# Altium project VISION_BETA_EBB.PrjPcb (part 4 of 9)

## Sheet HDMI.SchDoc
size A2; SheetNumber: 6; SheetTotal: 19
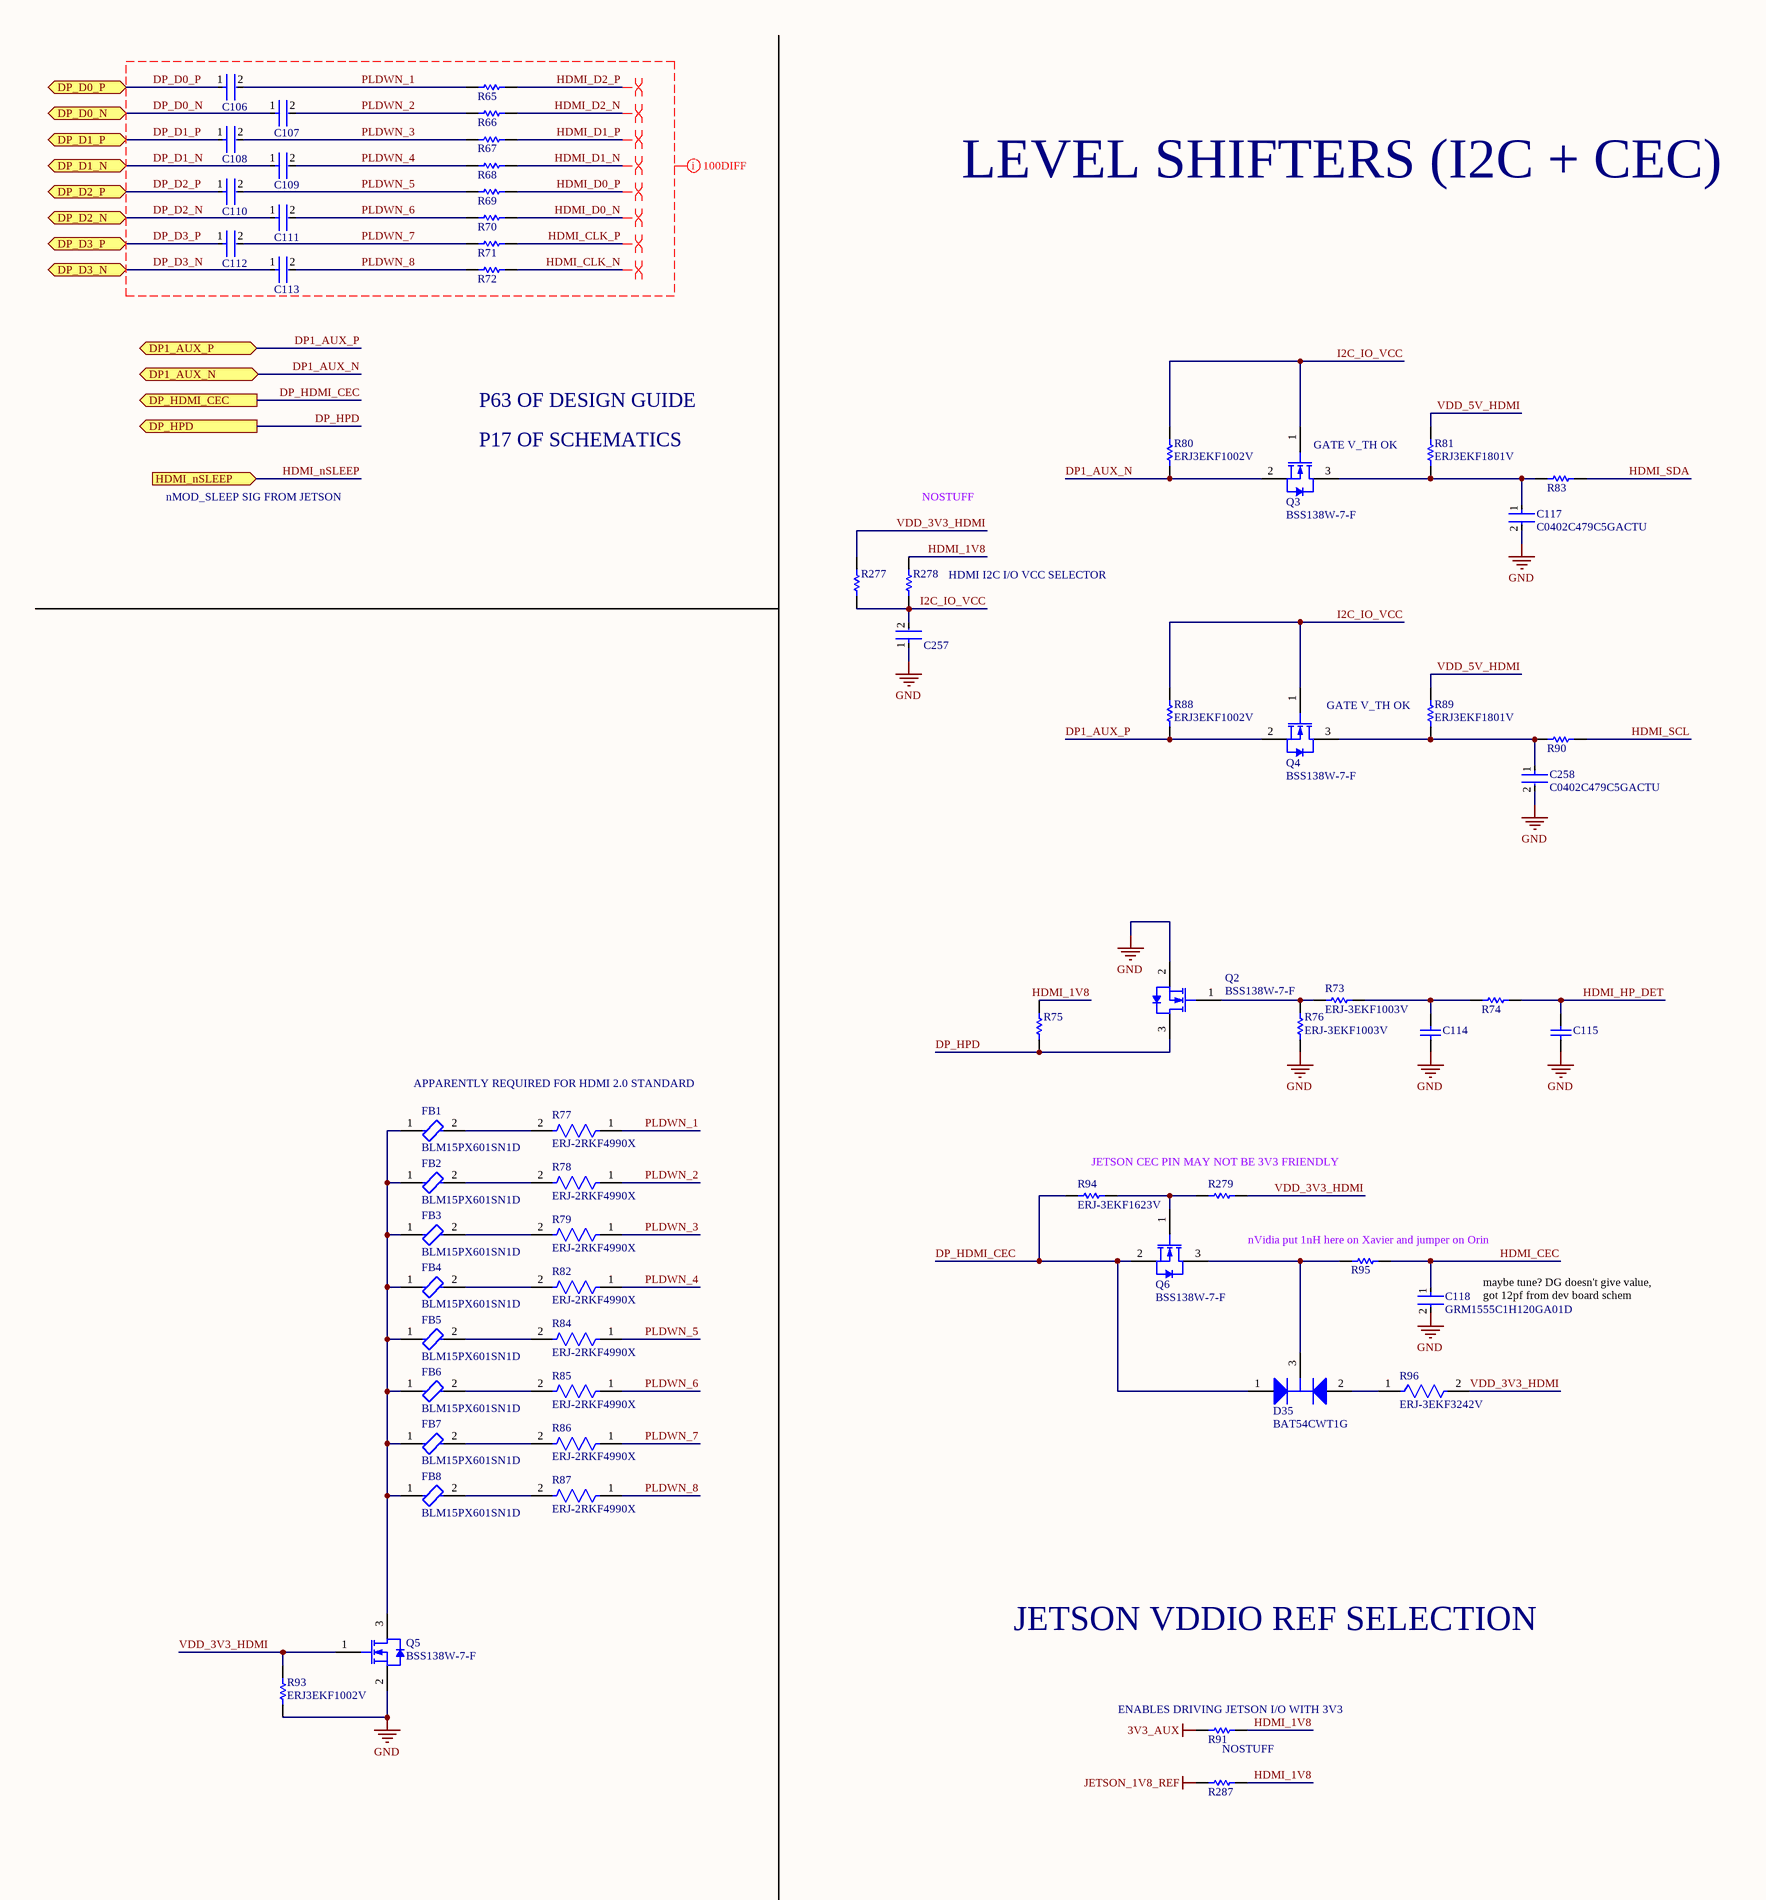
[diagram p19: HDMI.SchDoc, left]
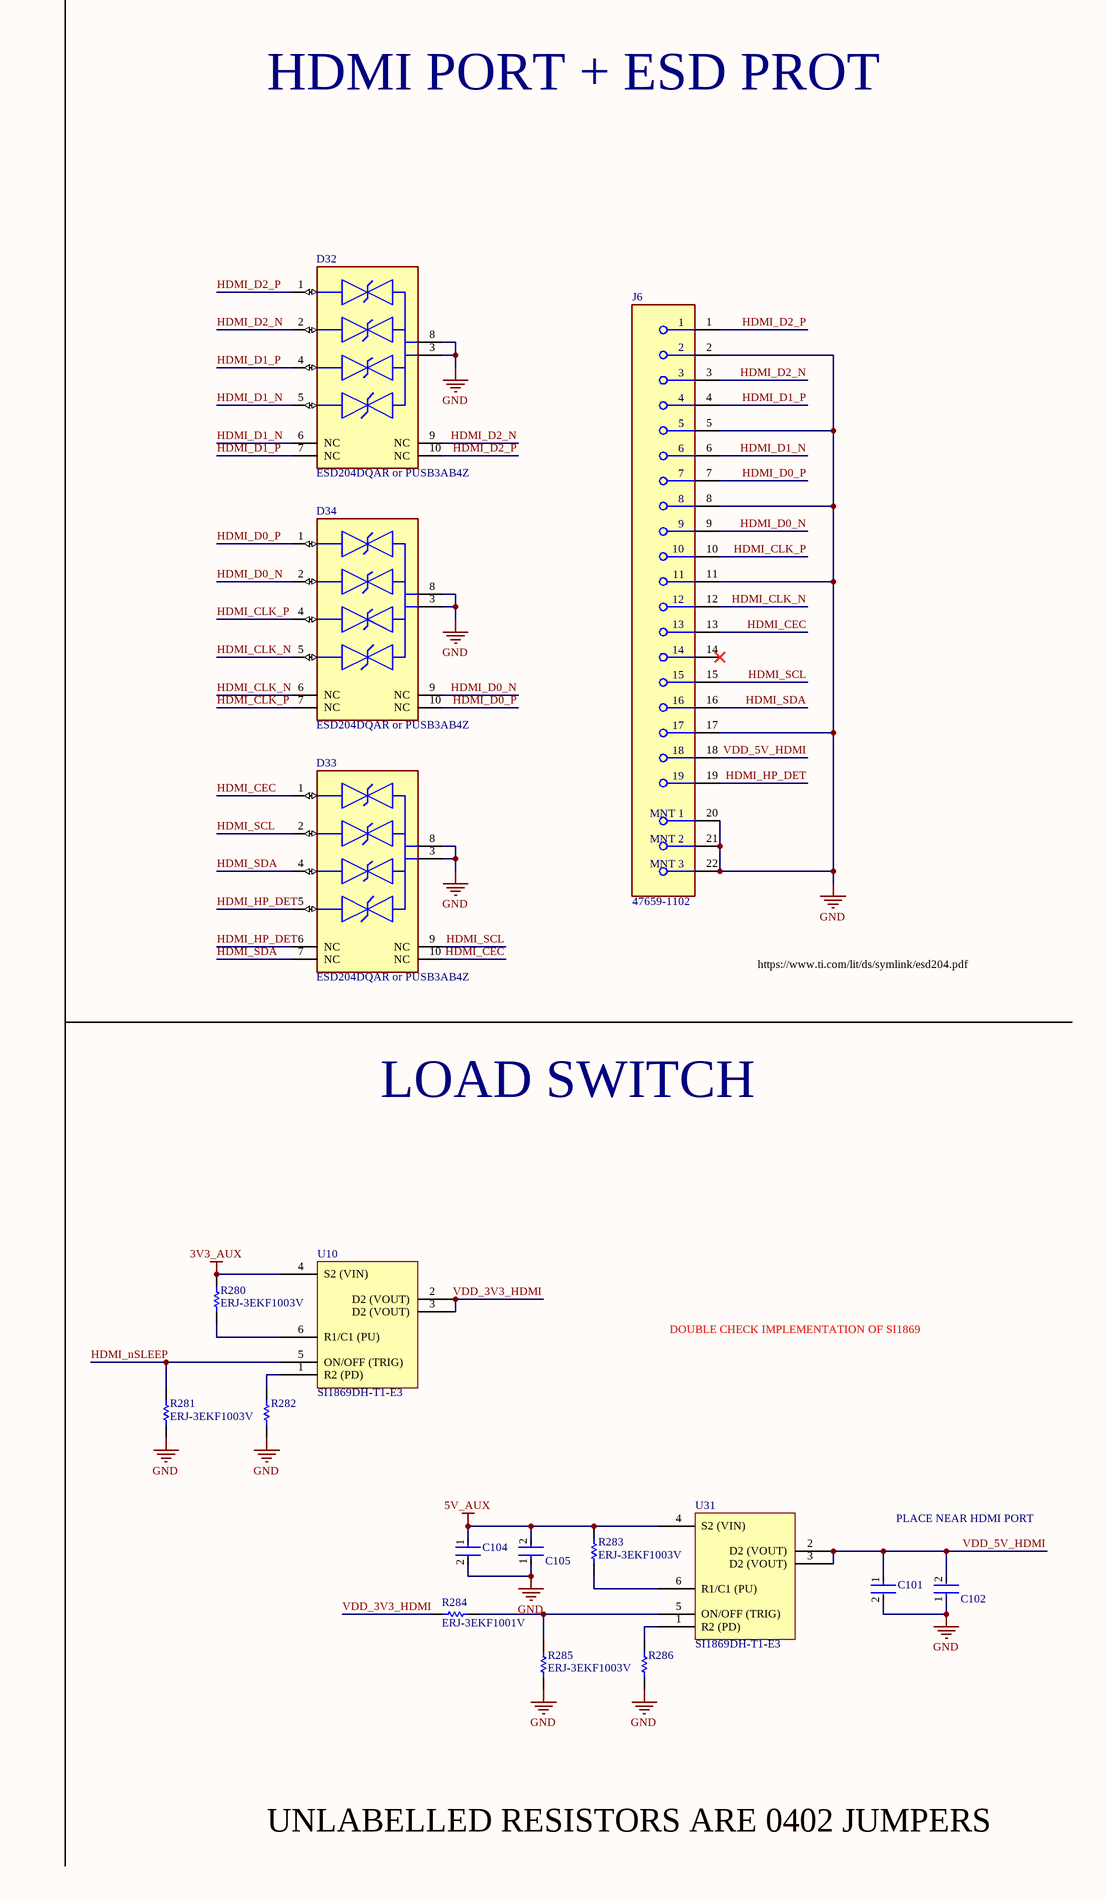
[diagram p20: HDMI.SchDoc, right]

### Parts
C101  GRM188R60J106ME47D  [FP-GRM188-0_1-e0_2_0_55-IPC_A]  (value not drawn)
C102  C1005X7R1H104K050BB  [FP-C1005-050-0_05-IPC_C]  (value not drawn)
C104  GRM188R60J106ME47D  [FP-GRM188-0_1-e0_2_0_55-IPC_A]  (value not drawn)
C105  C1005X7R1H104K050BB  [FP-C1005-050-0_05-IPC_C]  (value not drawn)
C106  C1005X7R1H104K050BB  [FP-C1005-050-0_05-IPC_C]  (value not drawn)
C107  C1005X7R1H104K050BB  [FP-C1005-050-0_05-IPC_C]  (value not drawn)
C108  C1005X7R1H104K050BB  [FP-C1005-050-0_05-IPC_C]  (value not drawn)
C109  C1005X7R1H104K050BB  [FP-C1005-050-0_05-IPC_C]  (value not drawn)
C110  C1005X7R1H104K050BB  [FP-C1005-050-0_05-IPC_C]  (value not drawn)
C111  C1005X7R1H104K050BB  [FP-C1005-050-0_05-IPC_C]  (value not drawn)
C112  C1005X7R1H104K050BB  [FP-C1005-050-0_05-IPC_C]  (value not drawn)
C113  C1005X7R1H104K050BB  [FP-C1005-050-0_05-IPC_C]  (value not drawn)
C114  C0402C221K5RAC7867  [CAPC1005X60X30NL05T10]  (value not drawn)
C115  C0402C221K5RAC7867  [CAPC1005X60X30NL05T10]  (value not drawn)
C117  C0402C479C5GACTU  [FP-C0402-BB-MFG]
C118  GRM1555C1H120GA01D  [FP-GRM155-0_05-MFG]
C257  C1005X7R1H104K050BB  [FP-C1005-050-0_05-IPC_C]  (value not drawn)
C258  C0402C479C5GACTU  [FP-C0402-BB-MFG]
D32  ESD204DQAR or PUSB3AB4Z  [FP-DQA0010A-MFG]
D33  ESD204DQAR or PUSB3AB4Z  [FP-DQA0010A-MFG]
D34  ESD204DQAR or PUSB3AB4Z  [FP-DQA0010A-MFG]
D35  BAT54CWT1G  [ONSC-SOT-323-3-419-04_V]
FB1  BLM15PX601SN1D  [FP-BLM15-0_05-MFG]
FB2  BLM15PX601SN1D  [FP-BLM15-0_05-MFG]
FB3  BLM15PX601SN1D  [FP-BLM15-0_05-MFG]
FB4  BLM15PX601SN1D  [FP-BLM15-0_05-MFG]
FB5  BLM15PX601SN1D  [FP-BLM15-0_05-MFG]
FB6  BLM15PX601SN1D  [FP-BLM15-0_05-MFG]
FB7  BLM15PX601SN1D  [FP-BLM15-0_05-MFG]
FB8  BLM15PX601SN1D  [FP-BLM15-0_05-MFG]
J6  47659-1102  [FP-47659-1102-MFG]
Q2  BSS138W-7-F  [DIOD-SOT323-3_V]
Q3  BSS138W-7-F  [DIOD-SOT323-3_V]
Q4  BSS138W-7-F  [DIOD-SOT323-3_V]
Q5  BSS138W-7-F  [DIOD-SOT323-3_V]
Q6  BSS138W-7-F  [DIOD-SOT323-3_V]
R65  0402 JUMPER  [RESC1005X40X25ML05T05]  (value not drawn)
R66  0402 JUMPER  [RESC1005X40X25ML05T05]  (value not drawn)
R67  0402 JUMPER  [RESC1005X40X25ML05T05]  (value not drawn)
R68  0402 JUMPER  [RESC1005X40X25ML05T05]  (value not drawn)
R69  0402 JUMPER  [RESC1005X40X25ML05T05]  (value not drawn)
R70  0402 JUMPER  [RESC1005X40X25ML05T05]  (value not drawn)
R71  0402 JUMPER  [RESC1005X40X25ML05T05]  (value not drawn)
R72  0402 JUMPER  [RESC1005X40X25ML05T05]  (value not drawn)
R73  ERJ-3EKF1003V  [RESC1608X55X30ML15T15]
R74  0402 JUMPER  [RESC1005X40X25ML05T05]  (value not drawn)
R75  ERJ3EKF1002V  [RESC1609X55X30LL15T15]  (value not drawn)
R76  ERJ-3EKF1003V  [RESC1608X55X30ML15T15]
R77  ERJ-2RKF4990X  [FP-ERJ2RK-MFG]
R78  ERJ-2RKF4990X  [FP-ERJ2RK-MFG]
R79  ERJ-2RKF4990X  [FP-ERJ2RK-MFG]
R80  ERJ3EKF1002V  [RESC1609X55X30LL15T15]
R81  ERJ3EKF1801V  [RESC1608X55X30LL15T15]
R82  ERJ-2RKF4990X  [FP-ERJ2RK-MFG]
R83  0402 JUMPER  [RESC1005X40X25ML05T05]  (value not drawn)
R84  ERJ-2RKF4990X  [FP-ERJ2RK-MFG]
R85  ERJ-2RKF4990X  [FP-ERJ2RK-MFG]
R86  ERJ-2RKF4990X  [FP-ERJ2RK-MFG]
R87  ERJ-2RKF4990X  [FP-ERJ2RK-MFG]
R88  ERJ3EKF1002V  [RESC1609X55X30LL15T15]
R89  ERJ3EKF1801V  [RESC1608X55X30LL15T15]
R90  0402 JUMPER  [RESC1005X40X25ML05T05]  (value not drawn)
R91  0402 JUMPER  [RESC1005X40X25ML05T05]  (value not drawn)
R93  ERJ3EKF1002V  [RESC1609X55X30LL15T15]
R94  ERJ-3EKF1623V  [RESC1608X55X30ML15T15]
R95  0402 JUMPER  [RESC1005X40X25ML05T05]  (value not drawn)
R96  ERJ-3EKF3242V  [FP-ERJ3EK-MFG]
R277  0402 JUMPER  [RESC1005X40X25ML05T05]  (value not drawn)
R278  0402 JUMPER  [RESC1005X40X25ML05T05]  (value not drawn)
R279  0402 JUMPER  [RESC1005X40X25ML05T05]  (value not drawn)
R280  ERJ-3EKF1003V  [RESC1608X55X30ML15T15]
R281  ERJ-3EKF1003V  [RESC1608X55X30ML15T15]
R282  0402 JUMPER  [RESC1005X40X25ML05T05]  (value not drawn)
R283  ERJ-3EKF1003V  [RESC1608X55X30ML15T15]
R284  ERJ-3EKF1001V  [RESC1608X55X30LL15T15]
R285  ERJ-3EKF1003V  [RESC1608X55X30ML15T15]
R286  0402 JUMPER  [RESC1005X40X25ML05T05]  (value not drawn)
R287  0402 JUMPER  [RESC1005X40X25ML05T05]  (value not drawn)
U10  SI1869DH-T1-E3  [SOT65P242X110-6N]
U31  SI1869DH-T1-E3  [SOT65P242X110-6N]

### Ports
DP1_AUX_N (bidir, see VISION_BETA_EBB[6C], JETSON[9C]), DP1_AUX_P (bidir, see VISION_BETA_EBB[6C], JETSON[9C]), DP_D0_N (bidir, see VISION_BETA_EBB[6C]), DP_D0_P (bidir, see VISION_BETA_EBB[6C]), DP_D1_N (bidir, see VISION_BETA_EBB[6C]), DP_D1_P (bidir, see VISION_BETA_EBB[6C]), DP_D2_N (bidir, see VISION_BETA_EBB[6C]), DP_D2_P (bidir, see VISION_BETA_EBB[6C]), DP_D3_N (bidir, see VISION_BETA_EBB[6C]), DP_D3_P (bidir, see VISION_BETA_EBB[6C]), DP_HDMI_CEC (out, see VISION_BETA_EBB[6C], JETSON[9C]), DP_HPD (out, see VISION_BETA_EBB[6C]), HDMI_nSLEEP (in, see VISION_BETA_EBB[6C])

### Nets
3V3_AUX: R91.1 R280.2 U10.4(S2_(VIN))  [project net 3V3_AUX_FB]
5V_AUX: C104.1 C105.2 R283.2 U31.4(S2_(VIN))  [project net 5V_REG_FB]
GND: C101.2 C102.1 C104.2 C105.1 C114.1 C115.1 C117.2 C118.2 C257.1 C258.2 D32.3(GND) D32.8(GND) D33.3(GND) D33.8(GND) D34.3(GND) D34.8(GND) J6.2 J6.5 J6.8 J6.11 J6.17 J6.20(MNT_1) J6.21(MNT_2) J6.22(MNT_3) Q2.2(S) Q5.2(S) R76.1 R93.1 R281.1 R282.2 R285.1 R286.2
JETSON_1V8_REF: R287.1  [project net FAN_VDDIO]
DP1_AUX_N: Q3.2(S) R80.1 ; port DP1_AUX_N
DP1_AUX_P: Q4.2(S) R88.1 ; port DP1_AUX_P
DP_D0_N: C107.1 ; port DP_D0_N  [project net DP1_TXD0_N]
DP_D0_P: C106.1 ; port DP_D0_P  [project net DP1_TXD0_P]
DP_D1_N: C109.1 ; port DP_D1_N  [project net DP1_TXD1_N]
DP_D1_P: C108.1 ; port DP_D1_P  [project net DP1_TXD1_P]
DP_D2_N: C111.1 ; port DP_D2_N  [project net DP1_TXD2_N]
DP_D2_P: C110.1 ; port DP_D2_P  [project net DP1_TXD2_P]
DP_D3_N: C113.1 ; port DP_D3_N  [project net DP1_TXD3_N]
DP_D3_P: C112.1 ; port DP_D3_P  [project net DP1_TXD3_P]
DP_HDMI_CEC: D35.1(A1) Q6.2(S) R94.1 ; port DP_HDMI_CEC
DP_HPD: Q2.3(D) R75.1 ; port DP_HPD  [project net DP1_HPD]
HDMI_1V8: R75.2 R91.2 R278.2 R287.2
HDMI_CEC: C118.1 D33.1(IO1) D33.10(NC) J6.13 R95.2
HDMI_CLK_N: D34.5(IO4) D34.6(NC) J6.12 R72.2
HDMI_CLK_P: D34.4(IO3) D34.7(NC) J6.10 R71.2
HDMI_D0_N: D34.2(IO2) D34.9(NC) J6.9 R70.2
HDMI_D0_P: D34.1(IO1) D34.10(NC) J6.7 R69.2
HDMI_D1_N: D32.5(IO4) D32.6(NC) J6.6 R68.2
HDMI_D1_P: D32.4(IO3) D32.7(NC) J6.4 R67.2
HDMI_D2_N: D32.2(IO2) D32.9(NC) J6.3 R66.2
HDMI_D2_P: D32.1(IO1) D32.10(NC) J6.1 R65.2
HDMI_HP_DET: C115.2 D33.5(IO4) D33.6(NC) J6.19 R74.2
HDMI_nSLEEP: R281.2 U10.5(ON/OFF_(TRIG)) ; port HDMI_nSLEEP
HDMI_SCL: D33.2(IO2) D33.9(NC) J6.15 R90.2
HDMI_SDA: D33.4(IO3) D33.7(NC) J6.16 R83.2
I2C_IO_VCC: C257.2 Q3.1(G) Q4.1(G) R80.2 R88.2 R277.1 R278.1
PLDWN_1: C106.2 R65.1 R77.1
PLDWN_2: C107.2 R66.1 R78.1
PLDWN_3: C108.2 R67.1 R79.1
PLDWN_4: C109.2 R68.1 R82.1
PLDWN_5: C110.2 R69.1 R84.1
PLDWN_6: C111.2 R70.1 R85.1
PLDWN_7: C112.2 R71.1 R86.1
PLDWN_8: C113.2 R72.1 R87.1
VDD_3V3_HDMI: Q5.1(G) R93.2 R96.2 R277.2 R279.1 R284.1 U10.2(D2_(VOUT)) U10.3(D2_(VOUT))
VDD_5V_HDMI: C101.1 C102.2 J6.18 R81.2 R89.2 U31.2(D2_(VOUT)) U31.3(D2_(VOUT))
NetC114_2: C114.2 R73.2 R74.1
NetC117_1: C117.1 Q3.3(D) R81.1 R83.1
NetC258_1: C258.1 Q4.3(D) R89.1 R90.1
NetD35_2: D35.2(A2) R96.1
NetD35_3: D35.3(K) Q6.3(D) R95.1
NetFB1_1: FB1.1 FB2.1 FB3.1 FB4.1 FB5.1 FB6.1 FB7.1 FB8.1 Q5.3(D)
NetFB1_2: FB1.2 R77.2
NetFB2_2: FB2.2 R78.2
NetFB3_2: FB3.2 R79.2
NetFB4_2: FB4.2 R82.2
NetFB5_2: FB5.2 R84.2
NetFB6_2: FB6.2 R85.2
NetFB7_2: FB7.2 R86.2
NetFB8_2: FB8.2 R87.2
NetQ2_1: Q2.1(G) R73.1 R76.2
NetQ6_1: Q6.1(G) R94.2 R279.2
NetR280_1: R280.1 U10.6(R1/C1_(PU))
NetR282_1: R282.1 U10.1(R2_(PD))
NetR283_1: R283.1 U31.6(R1/C1_(PU))
NetR284_2: R284.2 R285.2 U31.5(ON/OFF_(TRIG))
NetR286_1: R286.1 U31.1(R2_(PD))

Not connected (* = marked no-connect by the designer): J6 14*

### Layout directives
differential pair; differential pair class 100DIFF: HDMI_CLK_N, HDMI_CLK_P, HDMI_D0_N, HDMI_D0_P, HDMI_D1_N, HDMI_D1_P, HDMI_D2_N, HDMI_D2_P
net class 100DIFF: DP_D0_N, DP_D0_P, DP_D1_N, DP_D1_P, DP_D2_N, DP_D2_P, DP_D3_N, DP_D3_P, HDMI_CLK_N, HDMI_CLK_P, HDMI_D0_N, HDMI_D0_P, HDMI_D1_N, HDMI_D1_P, HDMI_D2_N, HDMI_D2_P, PLDWN_1, PLDWN_2, PLDWN_3, PLDWN_4, PLDWN_5, PLDWN_6, PLDWN_7, PLDWN_8

### Notes on the sheet
- HDMI PORT + ESD PROT
- LEVEL SHIFTERS (I2C + CEC)
- P63 OF DESIGN GUIDE
- nMOD_SLEEP SIG FROM JETSON
- P17 OF SCHEMATICS
- NOSTUFF
- (near Q3) GATE V_TH OK
- HDMI I2C I/O VCC SELECTOR
- (near Q4) GATE V_TH OK
- APPARENTLY REQUIRED FOR HDMI 2.0 STANDARD
- https://www.ti.com/lit/ds/symlink/esd204.pdf
- JETSON CEC PIN MAY NOT BE 3V3 FRIENDLY
- LOAD SWITCH
- (near R95) nVidia put 1nH here on Xavier and jumper on Orin
- maybe tune? DG doesn't give value, got 12pf from dev board schem
- DOUBLE CHECK IMPLEMENTATION OF SI1869
- JETSON VDDIO REF SELECTION
- PLACE NEAR HDMI PORT
- (near R91) ENABLES DRIVING JETSON I/O WITH 3V3
- (near R91) NOSTUFF
- UNLABELLED RESISTORS ARE 0402 JUMPERS

### Library data of the parts
C101 C104 = CMP-2006-02792-2: Chip Multilayer Ceramic Capacitors for General Purpose, 0603, 10uF, X5R, 15%, 20%, 6.3V; Packaging: Tape and Reel; Voltage Rating (DC): 6.3V; Width: 0.031inch; Termination: SMD/SMT; Dielectric: X5R; Package Quantity: 4000; Voltage Rating: 6.3V; Capacitance: 10uF; Case/Package: 0603; Min Operating Temperature: -55°C; Voltage: 6.3V; Length: 1.6mm; Thickness: 0.035inch; Lead Free: Lead Free; Depth: 0.8mm; Case Code (Imperial): 0603; Max Operating Temperature: 85°C; Material: Ceramic; Height: 0.8mm; Tolerance: 20%; Mount: Surface Mount; REACH SVHC: No SVHC; Radiation Hardening: No; Case Code (Metric): 1608
C102 C105-C113 C257 = CMP-2000-05393-2: Multilayer Ceramic Capacitors 100nF ±10% 50V X7R SMD 0402; Voltage: 50V; Dielectric Material: Ceramic; Min Operating Temperature: -55°C; Depth: 0.5mm; Radiation Hardening: No; RoHS Compliant: Yes; Voltage Rating (DC): 50V; Lead Free: Lead Free; Resistor Type: Ceramic; Height: 0.5mm; Dielectric: X7R; Thickness: 0.022inch; Case/Package: 0402; Case Code (Metric): 1005; Termination: SMD/SMT; Capacitance: 100nF; Packaging: Tape and Reel; Max Operating Temperature: 125°C; Mount: Surface Mount; Package Quantity: 1; Width: 0.02inch; Weight: 2.3E-05oz; Voltage Rating: 50V; Tolerance: 10%; Construction: Flat; Case Code (Imperial): 0402; Length: 1mm; REACH SVHC: No SVHC; Series: C
C114 C115 = CMP-2008-03137-2: Manufacturer: Kemet; Part Number: C0402C221K5RAC7867
C117 C258 = CMP-2008-03310-2: CAP CER 4.7PF 50V NP0 0402; Manufacturer: Kemet; Material: Ceramic; Tolerance: 0.25 pF; Temperature Coefficient: 15%; Temperature Characteristic: C0G; Manufacturer Part Number: C0402C479C5GACTU; Lead Free: Yes; Device Class L1: Passive Components; ComponentLink2Description: Datasheet; Temperature: -55°C to +125°C; Digikey Description: CAP CER 4.7PF 50V NP0 0402; Ipc Land Pattern Name: CAPC10050X50; ComponentLink2URL: https://content.kemet.com/datasheets/KEM_C1002_X7R_SMD.pdf; Octopart: https://octopart.com/c0402c479c5gactu-kemet-9144199; Mouser Description: Multilayer Ceramic Capacitors MLCC - SMD/SMT 50volts 4.7pF C0G .25pF; Automotive: No; Voltage Rating: 50 V; Device Class L3: Ceramic Capacitors; Capacitance: 4.7 pF; Category: Cap; Value: 4.7 pF; Package: C0402-BB; Height: 0.55mm; Temperature Range Low: -55°C; RoHS: TRUE; Device Class L2: Capacitors; Temperature Range High: +125°C
C118 = CMP-2008-03945-2: CAP CER 12PF 50V C0G/NP0 0402; Tolerance: 2%; Dielectric: C0G; Material: Ceramic; Termination: SMD/SMT; Mount: Surface Mount; REACH SVHC: No SVHC; Depth: 0.5mm; Case Code (Metric): 1005; Voltage Rating: 50V; Height: 0.5mm; Voltage Rating (DC): 50V; Case Code (Imperial): 0402; Package Quantity: 10000; Construction: Flat; Thickness: 0.022inch; Length: 1mm; Min Operating Temperature: -55°C; Width: 0.5mm; Lead Free: Lead Free; Capacitance: 12pF; Case/Package: 0402; Packaging: Tape and Reel; Series: GRM; Voltage: 50V; Radiation Hardening: No; Max Operating Temperature: 125°C
D32-D34 = CMP-04989-000002-1: 4-CHANNEL LOW-CAPACITANCE SURGE; Manufacturer: Texas Instruments; Value: 0.55pF; Reverse Standoff Voltage: 3.6V; Standoff Height: 0mm; Breakdown Voltage: 5.5V; Peak Pulse Current: 5.5A; Clamping Voltage: 11.5V; Direction: Bidirectional; Peak Pulse Power: 50W; Number Of Channels: 4; Ambient Temperature Range High: +125°C; ComponentLink2Description: Datasheet; Height: 0.55mm; Lead Free: Yes; Device Class L3: unset; Temperature Range High: +125°C; Temperature Range Low: -40°C; Package: DQA0010A; Temperature: -40°C to +125°C; Capacitance: 0.55pF; RoHS: TRUE; Mouser Description: 4-Channel Low-Capacitance Surge and ESD Protection Diode 10-USON -40 to 125; Category: Diode; Device Class L1: Circuit Protection; Octopart: https://octopart.com/esd204dqar-texas+instruments-89917476; Device Class L2: TVS Diodes; Ambient Temperature Range Low: -40°C; Manufacturer Part Number: ESD204DQAR; ComponentLink2URL: http://www.ti.com/lit/ds/symlink/esd204.pdf; Automotive: No; Digikey Description: 4-CHANNEL LOW-CAPACITANCE SURGE
D35 = CMP-1055-00557-1: Dual Series Cathode Schottky Barrier Diodes, 3-Pin SOT-323, Pb-Free, Tape and Reel; Manufacturer: On Semiconductor; Configuration: Common Cathode; IFSM Max (A): 0.6; trr Max (ns): 5; ComponentLink2Description: Datasheet; Packing: Tape and Reel; ComponentLink3Description: Package Specification; Mounting Technology: Surface Mount; PartNumber: BAT54CWT1G; PackageVersion: Rev. N, 11/2008; RoHS: TRUE; ComponentLink3URL: http://www.onsemi.com/pub_link/Collateral/419-04.PDF; ComponentLink2URL: http://www.onsemi.cn/pub_link/Collateral/BAT54CWT1-D.PDF; PackageReference: SOT-323-3-419-04; ComponentLink1URL: http://www.onsemi.com/; ComponentLink1Description: Manufacturer URL; DatasheetVersion: Rev. 7; PackageDescription: 3-Pin Small Outline Transistor, Body 2 x 1.25 mm, Pitch 0.65 mm
FB1-FB8 = CMP-0686-00252-4: Chip Ferrite Bead, 0402, 600Ω @ 100MHz, 0.23Ω, 25%, 900mA; Number of Circuits: 1; Impedance: 600R; DC Resistance (DCR): 230mR; Material: Steel; Length: 1mm; Package Quantity: 10000; Height: 0.5mm; Width: 0.5mm; Max DC Current: 900mA; Number of Lines: 1; Termination: SMD/SMT; Packaging: Tape and Reel; Lead Free: Lead Free; Min Operating Temperature: -55°C; Max Operating Temperature: 125°C; Max Current Rating: 900mA; Case Code (Imperial): 0402; Number of Pins: 2; Current Rating: 900mA; Test Frequency: 100MHz; Case/Package: 0402; Tolerance: 25%; Case Code (Metric): 1005
J6 = CMP-04768-000010-1: HDMI REC.VERTICAL SMT TYPE W/HEI; RoHS Compliant: Yes
Q2-Q6 = CMP-2000-05968-1: N-Channel Enhancement Mode Mosfet, 50 V, 200 mA, -55 to 150 degC, 6-Pin SOT-323, RoHS, Tape and Reel; Typical Turn-Off Delay Time: 20ns; Number of Channels: 1Channel; Type: EnhancementModeFieldEffectTransistor; Brand: DiodesIncorporated; Vds - Drain-Source Breakdown Voltage: 75V; Vgs - Gate-Source Voltage: 20V; Rds On - Drain-Source Resistance: 1.4Ohms; Transistor Type: 1N-Channel; Configuration: Single; Unit Weight: 0.000212oz; Pd - Power Dissipation: 200mW; Id - Continuous Drain Current: 200mA; Forward Transconductance - Min: 0.1S; Manufacturer URL: http://www.diodes.com/; Series: BSS138; Package Description: 3-Pin Small Outline Transistor, Body 2 x 1.25 mm, Pitch 0.65 mm; Mounting Technology: SurfaceMount; Product Category: MOSFET; RoHS: True; Maximum Operating Temperature: +150C; Height: 1mm; Length: 2.2mm; Technology: Si; Width: 1.35mm; Datasheet URL: http://www.diodes.com/_files/datasheets/ds30206.pdf; Manufacturer: DiodesIncorporated; Package / Case: SOT-323-3; Typical Turn-On Delay Time: 20ns; Transistor Polarity: N-Channel; Factory Pack Quantity: 3000; Packaging: Reel; Product: MOSFETSmallSignal; Datasheet Version: Rev. 11-2, 09/2013; Package Reference: SOT323; Minimum Operating Temperature: -55C; Mounting Style: SMD/SMT; Channel Mode: Enhancement
R65-R72 R74 R83 R90 R91 R95 R277-R279 R282 R286 R287 = CMP-009-00118-2: READ THE NAME; Pins: 2; Component Type: Standard; Design Item ID: CMP-009-00206-2; Source: 0402jump.SchLib
R73 R76 R280 R281 R283 R285 = CMP-2000-00182-1: Manufacturer: Panasonic; Part Number: ERJ-3EKF1003V
R75 R80 R88 R93 = CMP-1012-00623-3: Chip Resistor, 10 KOhm, +/- 1%, 0.1 W, -55 to 155 degC, 0603 (1608 Metric), RoHS, Tape and Reel; Manufacturer: Panasonic; Voltage Rating: 75V; Case\/Package: 0603; Power Rating: 100mW; Resistance: 10KOhm; Temperature Coefficient: 100ppm\/degreesC; Number of Pins: 2; Package Reference: 603; Depth: 0.8mm; Mount: SurfaceMount; Package Description: 2-Pin Surface Mount Device, Body 1.6 x 0.85 mm; Datasheet Version: 02/2017; Length: 1.6mm; Lead Free: LeadFree; Height: 0.45mm; Number of Terminations: 2; Max Power Dissipation: 100mW; Min Operating Temperature: -55degC; Datasheet URL: https://industrial.panasonic.com/cdbs/www-data/pdf/RDA0000/AOA0000C304.pdf; Termination: SMD/SMT; Case Code (Metric): 1608; Case Code (Imperial): 0603; Tolerance: 1%; Max Operating Temperature: 155degC; RoHSCompliant: true; Voltage Rating (DC): 75V; Radiation Hardening: No; Packaging: TapeandReel; Composition: ThickFilm; Mounting Technology: SurfaceMount; Manufacturer URL: http://www.panasonic.com/; Width: 0.031inch; REACH SVHC: NoSVHC; Contact Plating: Tin; Military Standard: Not; Package Quantity: 1
R77-R79 R82 R84-R87 = CMP-2002-00965-2: RES SMD 499 OHM 1% 1/10W 0402; Temperature Coefficient: 100ppm/°C; Max Power Dissipation: 100mW; Voltage Rating (DC): 50V; Resistance: 499R; Technology: THICK FILM; Min Operating Temperature: -55°C; Package Quantity: 1; Width: 0.02inch; Contact Plating: Tin; Tolerance: 1%; Features: Automotive AEC-Q200; Resistance Tolerance: 1%; Size Code: 0402; Military Standard: Not; Resistor Type: Thick Film; Case/Package: 0402; Mount: Surface Mount; Case Code (Metric): 1005; RoHS Compliant: Yes; REACH SVHC: No SVHC; Number of Terminations: 2; Construction: Rectangular; Packaging: Tape and Reel; Series: ERJ; Lead Free: Lead Free; Length: 1mm; Voltage Rating: 50V; Termination: SMD/SMT; Max Operating Temperature: 155°C; Case Code (Imperial): 0402; Height: 0.35mm; Power Rating: 100mW; Depth: 0.5mm
R81 R89 = CMP-2000-00389-1: MODIFIED P/N; Manufacturer: Panasonic; Part Number: ERJ3EKF2701V
R94 = CMP-1012-00758-2: Manufacturer: Panasonic; Part Number: ERJ-3EKF1623V
R96 = CMP-2000-00433-2: RES SMD 32.4K OHM 1% 1/10W 0603; Voltage Rating: 75V; Max Power Dissipation: 100mW; Temperature Coefficient: 100ppm/°C; Resistance: 32.4kR; Voltage Rating (DC): 50V; Technology: THICK FILM; Tolerance: 1%; Features: Automotive AEC-Q200; Width: 0.8mm; Case/Package: 0603; Min Operating Temperature: -55°C; Power Rating: 100mW; Contact Plating: Tin; Case Code (Imperial): 0603; Number of Terminations: 2; Lead Free: Lead Free; Length: 1.6mm; Series: ERJ; Packaging: Tape and Reel; RoHS Compliant: Yes; Military Standard: Not; Termination: SMD/SMT; Case Code (Metric): 1608; Max Operating Temperature: 155°C; Package Quantity: 1; Mount: Surface Mount; Resistor Type: Thick Film; Construction: Rectangular; Height: 0.45mm; Resistance Tolerance: 1%; Depth: 0.8mm; Radiation Hardening: No
R284 = CMP-2000-00180-1: Manufacturer: Panasonic; Part Number: ERJ-3EKF1001V
U10 U31 = CMP-019-00043-2: Power Supply Support Circuit, Adjustable, 1 Channel, PDSO6; Max Supply Voltage: 20V; Min Supply Voltage: 1.8V; Case/Package: TSSOP; Pins: 6; RoHS Compliant: Yes

## Sheet NVME.SchDoc
size C; SheetNumber: 7; SheetTotal: 19
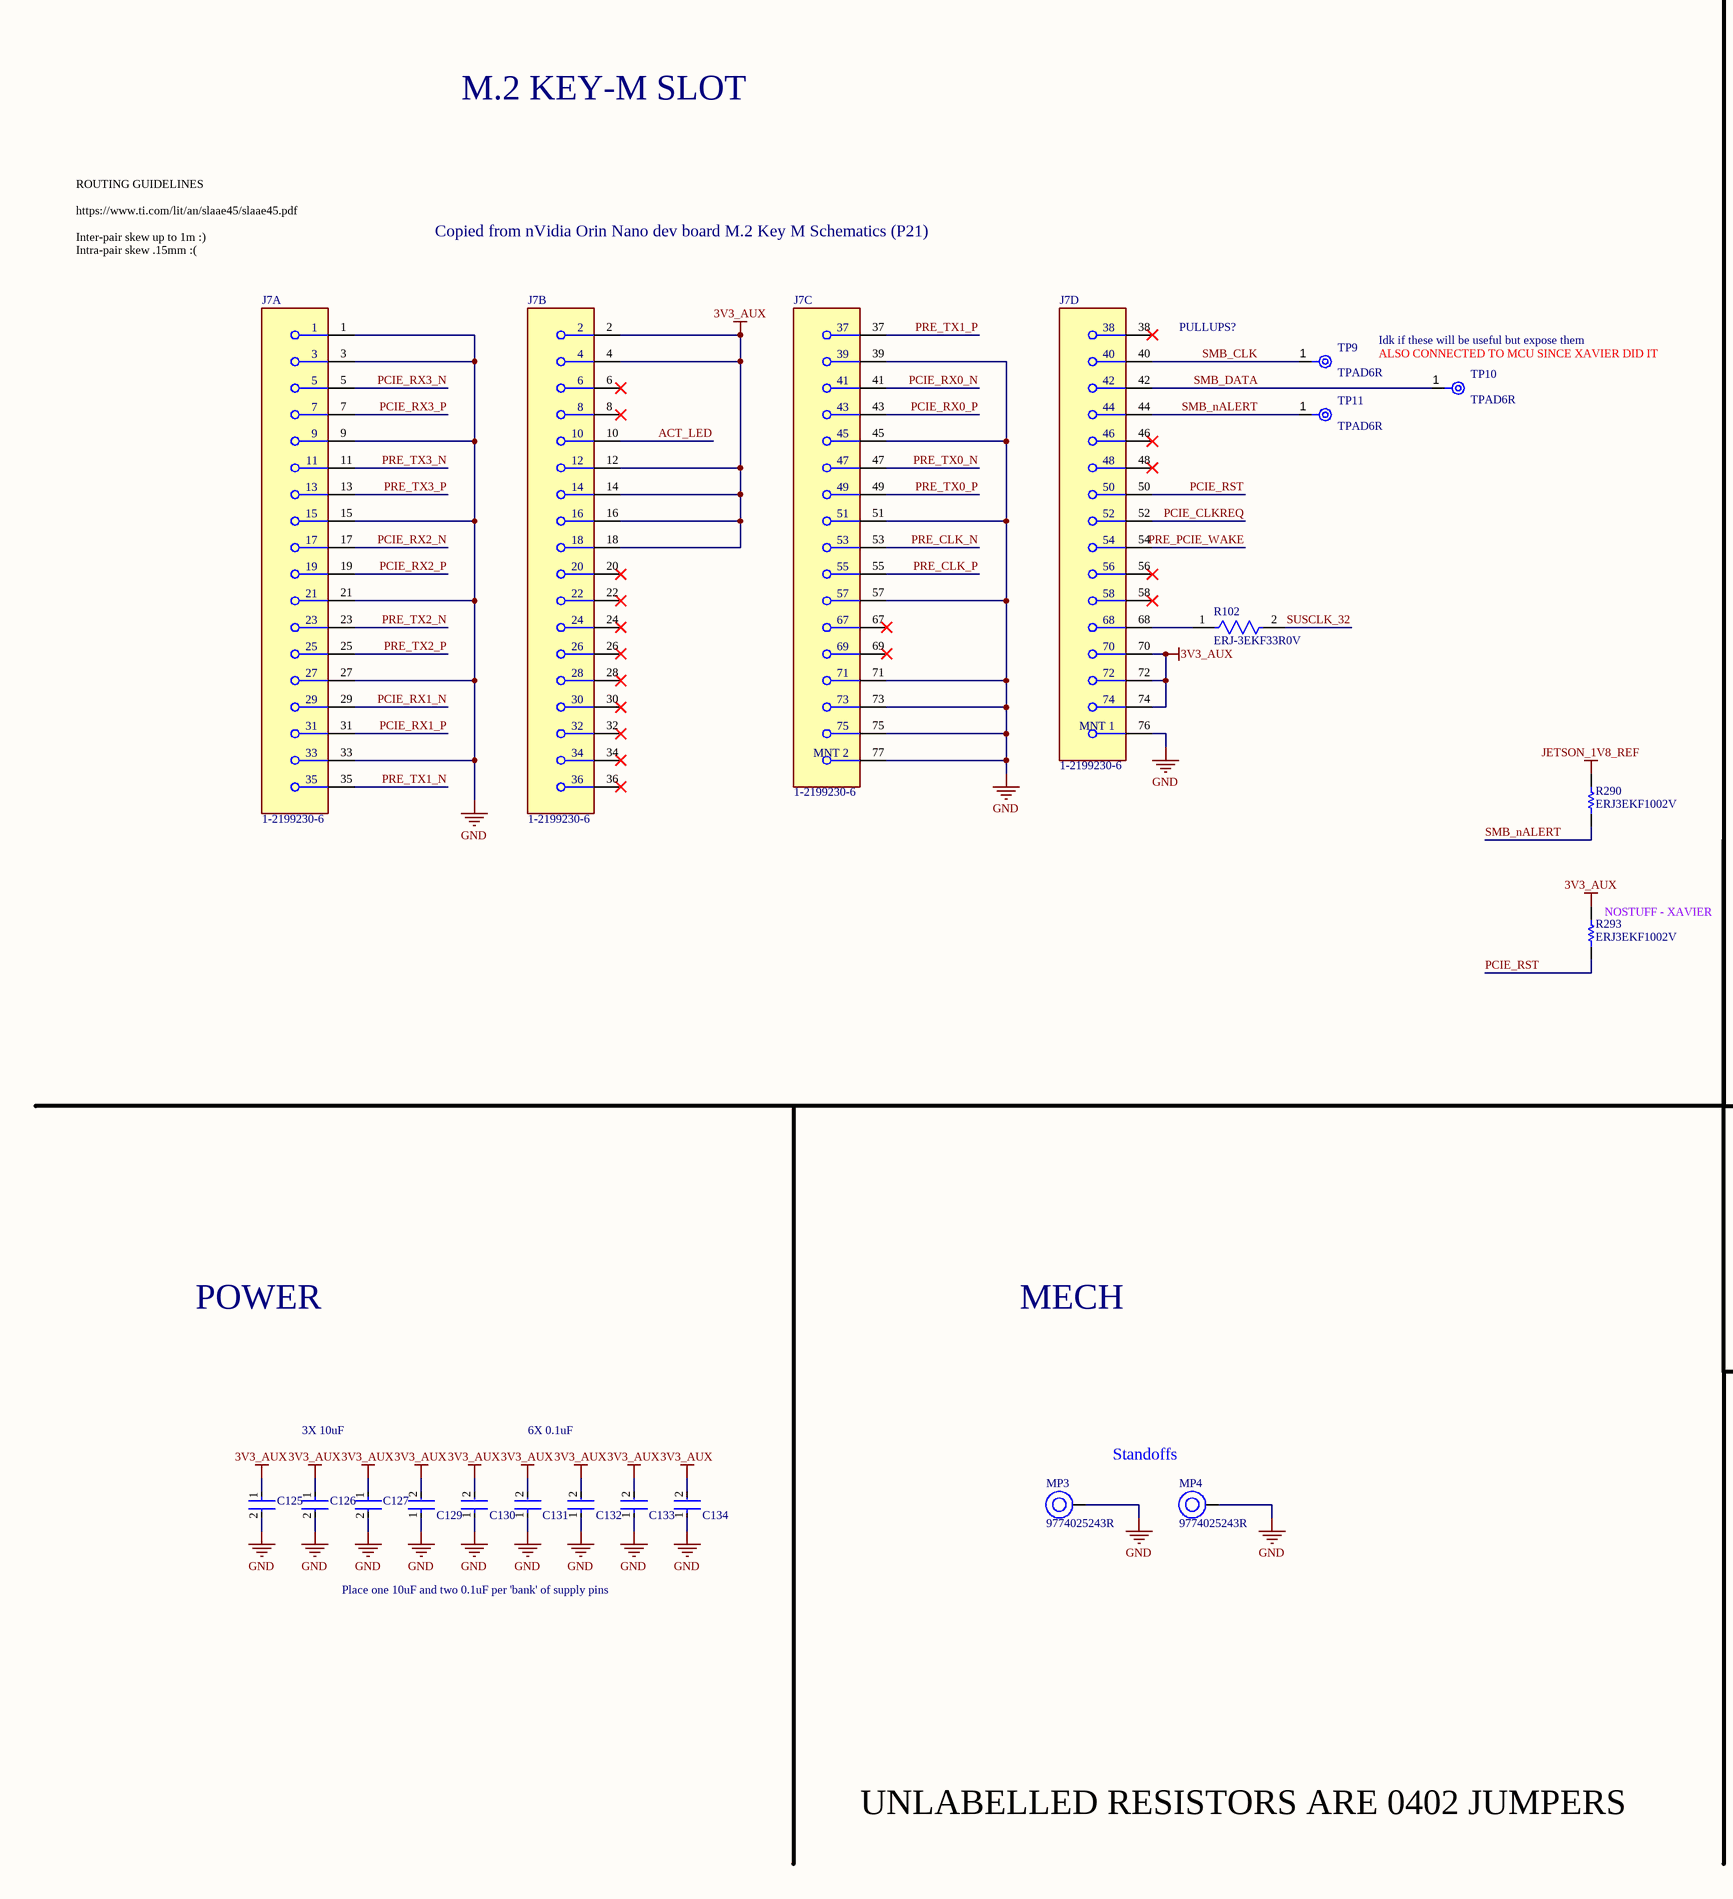
[diagram p21: NVME.SchDoc, left]
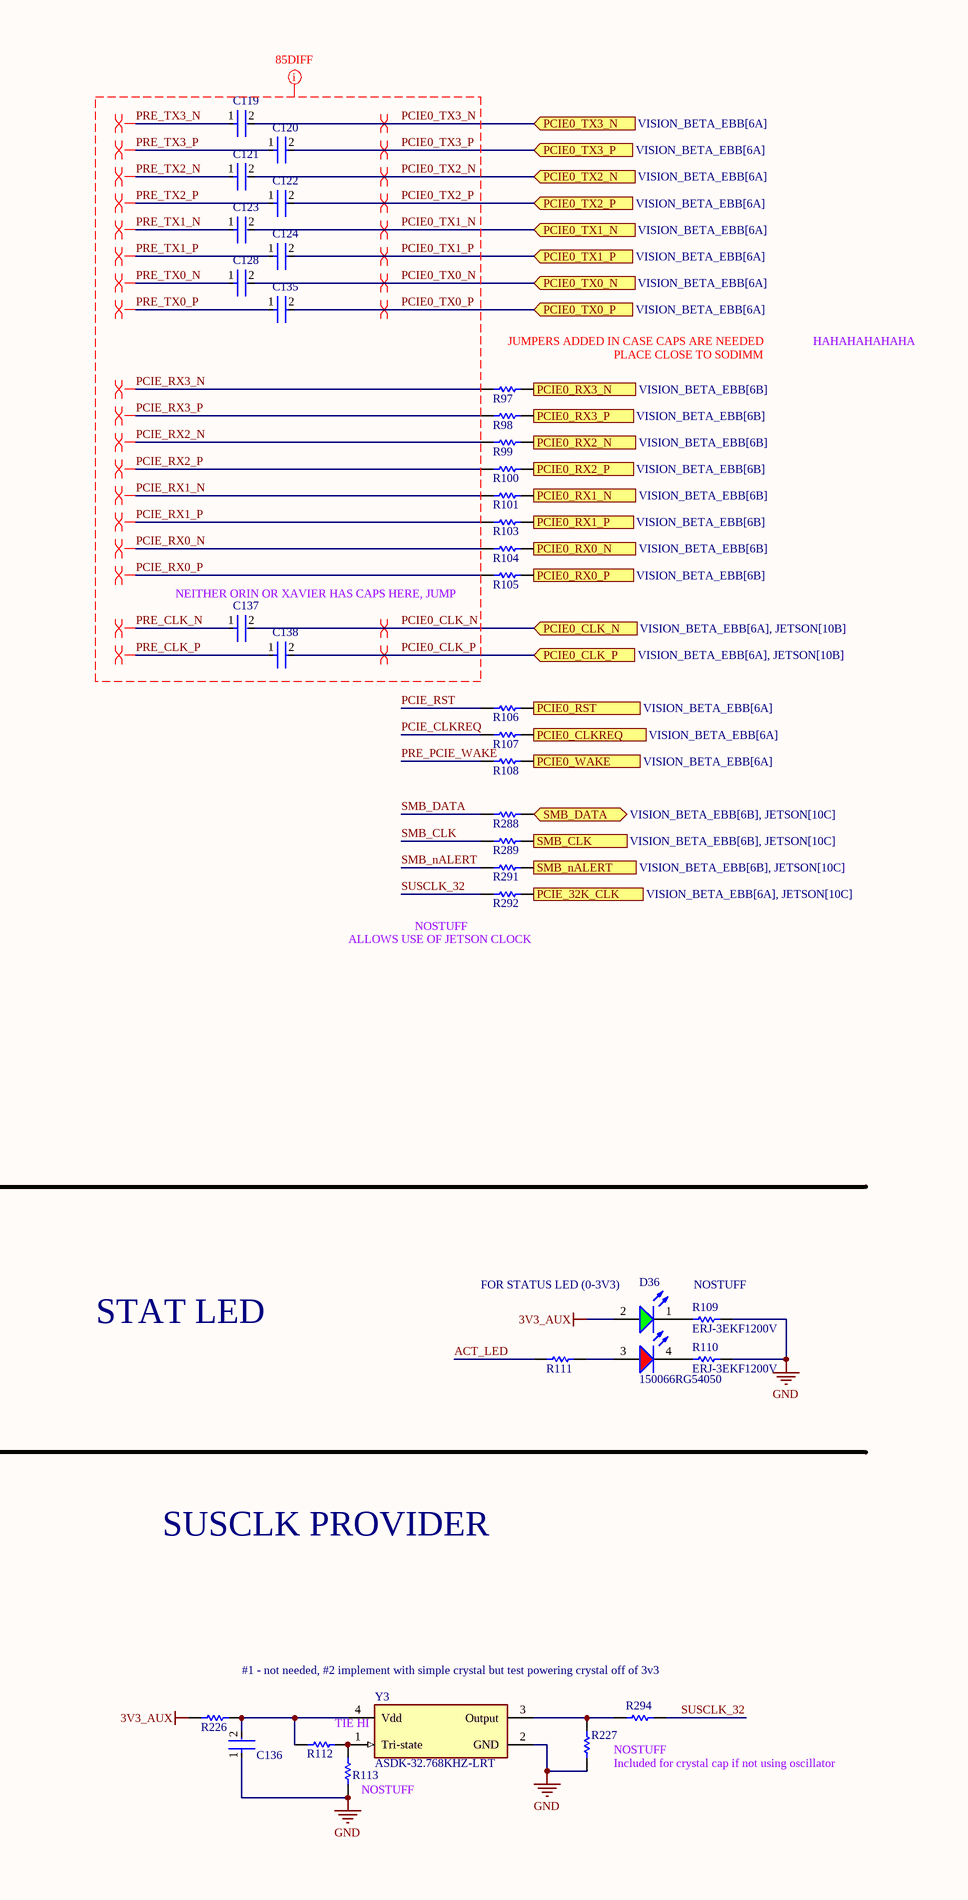
[diagram p22: NVME.SchDoc, right]

### Parts
C119  C1005X7R1A224K050BB  [FP-C1005-050-0_05-IPC_C]  (value not drawn)
C120  C1005X7R1A224K050BB  [FP-C1005-050-0_05-IPC_C]  (value not drawn)
C121  C1005X7R1A224K050BB  [FP-C1005-050-0_05-IPC_C]  (value not drawn)
C122  C1005X7R1A224K050BB  [FP-C1005-050-0_05-IPC_C]  (value not drawn)
C123  C1005X7R1A224K050BB  [FP-C1005-050-0_05-IPC_C]  (value not drawn)
C124  C1005X7R1A224K050BB  [FP-C1005-050-0_05-IPC_C]  (value not drawn)
C125  GRM188R60J106ME47D  [FP-GRM188-0_1-e0_2_0_55-IPC_A]  (value not drawn)
C126  GRM188R60J106ME47D  [FP-GRM188-0_1-e0_2_0_55-IPC_A]  (value not drawn)
C127  GRM188R60J106ME47D  [FP-GRM188-0_1-e0_2_0_55-IPC_A]  (value not drawn)
C128  C1005X7R1A224K050BB  [FP-C1005-050-0_05-IPC_C]  (value not drawn)
C129  C1005X7R1H104K050BB  [FP-C1005-050-0_05-IPC_C]  (value not drawn)
C130  C1005X7R1H104K050BB  [FP-C1005-050-0_05-IPC_C]  (value not drawn)
C131  C1005X7R1H104K050BB  [FP-C1005-050-0_05-IPC_C]  (value not drawn)
C132  C1005X7R1H104K050BB  [FP-C1005-050-0_05-IPC_C]  (value not drawn)
C133  C1005X7R1H104K050BB  [FP-C1005-050-0_05-IPC_C]  (value not drawn)
C134  C1005X7R1H104K050BB  [FP-C1005-050-0_05-IPC_C]  (value not drawn)
C135  C1005X7R1A224K050BB  [FP-C1005-050-0_05-IPC_C]  (value not drawn)
C136  C1005X7R1H104K050BB  [FP-C1005-050-0_05-IPC_C]  (value not drawn)
C137  C1005X7R1A224K050BB  [FP-C1005-050-0_05-IPC_C]  (value not drawn)
C138  C1005X7R1A224K050BB  [FP-C1005-050-0_05-IPC_C]  (value not drawn)
D36  150066RG54050  [WL-SBCD_0606]
J7  1-2199230-6  [FP-1-2199230-6-MFG]  (parts A,B,C,D of 4)
MP3  9774025243R  [9774025243]
MP4  9774025243R  [9774025243]
R97  0402 JUMPER  [RESC1005X40X25ML05T05]  (value not drawn)
R98  0402 JUMPER  [RESC1005X40X25ML05T05]  (value not drawn)
R99  0402 JUMPER  [RESC1005X40X25ML05T05]  (value not drawn)
R100  0402 JUMPER  [RESC1005X40X25ML05T05]  (value not drawn)
R101  0402 JUMPER  [RESC1005X40X25ML05T05]  (value not drawn)
R102  ERJ-3EKF33R0V  [FP-ERJ3EK-MFG]
R103  0402 JUMPER  [RESC1005X40X25ML05T05]  (value not drawn)
R104  0402 JUMPER  [RESC1005X40X25ML05T05]  (value not drawn)
R105  0402 JUMPER  [RESC1005X40X25ML05T05]  (value not drawn)
R106  0402 JUMPER  [RESC1005X40X25ML05T05]  (value not drawn)
R107  0402 JUMPER  [RESC1005X40X25ML05T05]  (value not drawn)
R108  0402 JUMPER  [RESC1005X40X25ML05T05]  (value not drawn)
R109  ERJ-3EKF1200V  [RESC1609X55X30ML15T15]
R110  ERJ-3EKF1200V  [RESC1609X55X30ML15T15]
R111  0402 JUMPER  [RESC1005X40X25ML05T05]  (value not drawn)
R112  0402 JUMPER  [RESC1005X40X25ML05T05]  (value not drawn)
R113  0402 JUMPER  [RESC1005X40X25ML05T05]  (value not drawn)
R226  0402 JUMPER  [RESC1005X40X25ML05T05]  (value not drawn)
R227  0402 JUMPER  [RESC1005X40X25ML05T05]  (value not drawn)
R288  0402 JUMPER  [RESC1005X40X25ML05T05]  (value not drawn)
R289  0402 JUMPER  [RESC1005X40X25ML05T05]  (value not drawn)
R290  ERJ3EKF1002V  [RESC1609X55X30LL15T15]
R291  0402 JUMPER  [RESC1005X40X25ML05T05]  (value not drawn)
R292  0402 JUMPER  [RESC1005X40X25ML05T05]  (value not drawn)
R293  ERJ3EKF1002V  [RESC1609X55X30LL15T15]
R294  0402 JUMPER  [RESC1005X40X25ML05T05]  (value not drawn)
TP9  TPAD6R  [New footprint 1]
TP10  TPAD6R  [New footprint 1]
TP11  TPAD6R  [New footprint 1]
Y3  ASDK-32.768KHZ-LRT  [FP-ASDK-MFG]

### Ports
PCIE0_CLK_N (in, see VISION_BETA_EBB[6A], JETSON[10B]), PCIE0_CLK_P (in, see VISION_BETA_EBB[6A], JETSON[10B]), PCIE0_CLKREQ (out, see VISION_BETA_EBB[6A]), PCIE0_RST (in, see VISION_BETA_EBB[6A]), PCIE0_RX0_N (out, see VISION_BETA_EBB[6B]), PCIE0_RX0_P (out, see VISION_BETA_EBB[6B]), PCIE0_RX1_N (out, see VISION_BETA_EBB[6B]), PCIE0_RX1_P (out, see VISION_BETA_EBB[6B]), PCIE0_RX2_N (out, see VISION_BETA_EBB[6B]), PCIE0_RX2_P (out, see VISION_BETA_EBB[6B]), PCIE0_RX3_N (out, see VISION_BETA_EBB[6B]), PCIE0_RX3_P (out, see VISION_BETA_EBB[6B]), PCIE0_TX0_N (in, see VISION_BETA_EBB[6A]), PCIE0_TX0_P (in, see VISION_BETA_EBB[6A]), PCIE0_TX1_N (in, see VISION_BETA_EBB[6A]), PCIE0_TX1_P (in, see VISION_BETA_EBB[6A]), PCIE0_TX2_N (in, see VISION_BETA_EBB[6A]), PCIE0_TX2_P (in, see VISION_BETA_EBB[6A]), PCIE0_TX3_N (in, see VISION_BETA_EBB[6A]), PCIE0_TX3_P (in, see VISION_BETA_EBB[6A]), PCIE0_WAKE (out, see VISION_BETA_EBB[6A]), PCIE_32K_CLK (in, see VISION_BETA_EBB[6A], JETSON[10C]), SMB_CLK (in, see VISION_BETA_EBB[6B], JETSON[10C]), SMB_DATA (bidir, see VISION_BETA_EBB[6B], JETSON[10C]), SMB_nALERT (out, see VISION_BETA_EBB[6B], JETSON[10C])

### Nets
3V3_AUX: C125.1 C126.1 C127.1 C129.2 C130.2 C131.2 C132.2 C133.2 C134.2 D36.2(A) J7.2 J7.4 J7.12 J7.14 J7.16 J7.18 J7.70 J7.72 J7.74 R226.1 R293.2  [project net 3V3_AUX_FB]
GND: C125.2 C126.2 C127.2 C129.1 C130.1 C131.1 C132.1 C133.1 C134.1 C136.1 J7.1 J7.3 J7.9 J7.15 J7.21 J7.27 J7.33 J7.39 J7.45 J7.51 J7.57 J7.71 J7.73 J7.75 J7.76(MNT_1) J7.77(MNT_2) MP3.1 MP4.1 R109.1 R110.1 R113.1 R227.1 Y3.2(GND)
JETSON_1V8_REF: R290.2  [project net FAN_VDDIO]
1V8_SMB_nALERT: R291.2 ; port SMB_nALERT
ACT_LED: J7.10 R111.1
FLIP4_N: R97.2 ; port PCIE0_RX3_N
FLIP4_P: R98.2 ; port PCIE0_RX3_P
FLIP5_N: R99.2 ; port PCIE0_RX2_N
FLIP5_P: R100.2 ; port PCIE0_RX2_P
FLIP6_N: R101.2 ; port PCIE0_RX1_N
FLIP6_P: R103.2 ; port PCIE0_RX1_P
FLIP7_N: R104.2 ; port PCIE0_RX0_N
FLIP7_P: R105.2 ; port PCIE0_RX0_P
I2C1_SCL: R289.2 ; port SMB_CLK
I2C1_SDA: R288.2 ; port SMB_DATA
PCIE0_CLK_N: C137.2 ; port PCIE0_CLK_N
PCIE0_CLK_P: C138.2 ; port PCIE0_CLK_P
PCIE0_nCLKREQ: R107.2 ; port PCIE0_CLKREQ
PCIE0_nRST: R106.2 ; port PCIE0_RST
PCIE0_TX0_N: C128.2 ; port PCIE0_TX0_N  [project net FLIP3_N]
PCIE0_TX0_P: C135.2 ; port PCIE0_TX0_P  [project net FLIP3_P]
PCIE0_TX1_N: C123.2 ; port PCIE0_TX1_N  [project net FLIP2_N]
PCIE0_TX1_P: C124.2 ; port PCIE0_TX1_P  [project net FLIP2_P]
PCIE0_TX2_N: C121.2 ; port PCIE0_TX2_N  [project net FLIP1_N]
PCIE0_TX2_P: C122.2 ; port PCIE0_TX2_P  [project net FLIP1_P]
PCIE0_TX3_N: C119.2 ; port PCIE0_TX3_N  [project net FLIP0_N]
PCIE0_TX3_P: C120.2 ; port PCIE0_TX3_P  [project net FLIP0_P]
PCIE_32K_CLK: R292.2 ; port PCIE_32K_CLK
PCIE_CLKREQ: J7.52 R107.1
PCIE_RST: J7.50 R106.1 R293.1
PCIE_RX0_N: J7.41 R104.1
PCIE_RX0_P: J7.43 R105.1
PCIE_RX1_N: J7.29 R101.1
PCIE_RX1_P: J7.31 R103.1
PCIE_RX2_N: J7.17 R99.1
PCIE_RX2_P: J7.19 R100.1
PCIE_RX3_N: J7.5 R97.1
PCIE_RX3_P: J7.7 R98.1
PCIE_WAKE: R108.2 ; port PCIE0_WAKE
PRE_CLK_N: C137.1 J7.53
PRE_CLK_P: C138.1 J7.55
PRE_PCIE_WAKE: J7.54 R108.1
PRE_TX0_N: C128.1 J7.47
PRE_TX0_P: C135.1 J7.49
PRE_TX1_N: C123.1 J7.35
PRE_TX1_P: C124.1 J7.37
PRE_TX2_N: C121.1 J7.23
PRE_TX2_P: C122.1 J7.25
PRE_TX3_N: C119.1 J7.11
PRE_TX3_P: C120.1 J7.13
SMB_CLK: J7.40 R289.1 TP9.1(TP)
SMB_DATA: J7.42 R288.1 TP10.1(TP)
SMB_nALERT: J7.44 R290.1 R291.1 TP11.1(TP)
SUSCLK_32: R102.2 R292.1 R294.1
NetC136_2: C136.2 R112.1 R226.2 Y3.4(Vdd)
NetD36_1: D36.1(K) R109.2
NetD36_3: D36.3(A) R111.2
NetD36_4: D36.4(K) R110.2
NetJ7_68: J7.68 R102.1
NetR112_2: R112.2 R113.2 Y3.1(Tri-state)
NetR227_2: R227.2 R294.2 Y3.3(Output)

Not connected (* = marked no-connect by the designer): J7 6* 8* 20* 22* 24* 26* 28* 30* 32* 34* 36* 38* 46* 48* 56* 58* 67* 69*

### Layout directives
differential pair; differential pair class 85DIFF: FLIP0_N, FLIP0_P, FLIP1_N, FLIP1_P, FLIP2_N, FLIP2_P, FLIP3_N, FLIP3_P, PCIE0_CLK_N, PCIE0_CLK_P, PCIE_RX0_N, PCIE_RX0_P, PCIE_RX1_N, PCIE_RX1_P, PCIE_RX2_N, PCIE_RX2_P, PCIE_RX3_N, PCIE_RX3_P, PRE_CLK_N, PRE_CLK_P, PRE_TX0_N, PRE_TX0_P, PRE_TX1_N, PRE_TX1_P, PRE_TX2_N, PRE_TX2_P, PRE_TX3_N, PRE_TX3_P
net class 85DIFF: PCIE0_CLK_N, PCIE0_CLK_P, PCIE0_TX0_N, PCIE0_TX0_P, PCIE0_TX1_N, PCIE0_TX1_P, PCIE0_TX2_N, PCIE0_TX2_P, PCIE0_TX3_N, PCIE0_TX3_P, PCIE_RX0_N, PCIE_RX0_P, PCIE_RX1_N, PCIE_RX1_P, PCIE_RX2_N, PCIE_RX2_P, PCIE_RX3_N, PCIE_RX3_P, PRE_CLK_N, PRE_CLK_P, PRE_TX0_N, PRE_TX0_P, PRE_TX1_N, PRE_TX1_P, PRE_TX2_N, PRE_TX2_P, PRE_TX3_N, PRE_TX3_P

### Notes on the sheet
- M.2 KEY-M SLOT
- ROUTING GUIDELINES
  https://www.ti.com/lit/an/slaae45/slaae45.pdf
  Inter-pair skew up to 1m :)
  Intra-pair skew .15mm :(
- Copied from nVidia Orin Nano dev board M.2 Key M Schematics (P21)
- (near R97) JUMPERS ADDED IN CASE CAPS ARE NEEDED
- HAHAHAHAHAHA
- PULLUPS?
- PLACE CLOSE TO SODIMM
- (near TP10) Idk if these will be useful but expose them
- (near TP10) ALSO CONNECTED TO MCU SINCE XAVIER DID IT
- (near C137) NEITHER ORIN OR XAVIER HAS CAPS HERE, JUMP
- (near R292) ALLOWS USE OF JETSON CLOCK
- NOSTUFF
- (near R293) NOSTUFF - XAVIER
- STAT LED
- (near D36) FOR STATUS LED (0-3V3)
- (near R109) NOSTUFF
- POWER
- MECH
- 3X 10uF
- 6X 0.1uF
- Standoffs
- SUSCLK PROVIDER
- Place one 10uF and two 0.1uF per 'bank' of supply pins
- #1 - not needed, #2 implement with simple crystal but test powering crystal off of 3v3
- (near Y3) TIE HI
- (near R113) NOSTUFF
- Included for crystal cap if not using oscillator
- UNLABELLED RESISTORS ARE 0402 JUMPERS

### Library data of the parts
C119-C124 C128 C135 C137 C138 = CMP-08246-006072-1: Multilayer Ceramic Capacitors 220nF ±10% 10V X7R SMD 0402; Resistor Type: Ceramic; Dielectric: X7R; Voltage Rating (DC): 10V; Width: 0.02inch; Case Code (Metric): 1005; Mount: Surface Mount; Termination: SMD/SMT; Series: C; Tolerance: 10%; Depth: 0.5mm; Length: 1mm; Packaging: Tape and Reel; Radiation Hardening: No; Weight: 2.3E-05oz; Voltage Rating: 10V; Thickness: 0.022inch; Capacitance: 220nF; Case Code (Imperial): 0402; Lead Free: Lead Free; Case/Package: 0402; Package Quantity: 10000; Dielectric Material: Ceramic; RoHS Compliant: Yes; REACH SVHC: No SVHC; Min Operating Temperature: -55°C; Max Operating Temperature: 125°C; Height: 0.5mm; Construction: Flat
C125-C127 = CMP-2006-02792-2: as C101 on sheet HDMI; Packaging: Tape and Reel; Voltage Rating (DC): 6.3V; Width: 0.031inch; Termination: SMD/SMT; Dielectric: X5R; Package Quantity: 4000; Voltage Rating: 6.3V; Capacitance: 10uF; Case/Package: 0603; Min Operating Temperature: -55°C; Voltage: 6.3V; Length: 1.6mm; Thickness: 0.035inch; Lead Free: Lead Free; Depth: 0.8mm; Case Code (Imperial): 0603; Max Operating Temperature: 85°C; Material: Ceramic; Height: 0.8mm; Tolerance: 20%; Mount: Surface Mount; REACH SVHC: No SVHC; Radiation Hardening: No; Case Code (Metric): 1608
C129-C134 C136 = CMP-2000-05393-2: as C102 on sheet HDMI; Voltage: 50V; Dielectric Material: Ceramic; Min Operating Temperature: -55°C; Depth: 0.5mm; Radiation Hardening: No; RoHS Compliant: Yes; Voltage Rating (DC): 50V; Lead Free: Lead Free; Resistor Type: Ceramic; Height: 0.5mm; Dielectric: X7R; Thickness: 0.022inch; Case/Package: 0402; Case Code (Metric): 1005; Termination: SMD/SMT; Capacitance: 100nF; Packaging: Tape and Reel; Max Operating Temperature: 125°C; Mount: Surface Mount; Package Quantity: 1; Width: 0.02inch; Weight: 2.3E-05oz; Voltage Rating: 50V; Tolerance: 10%; Construction: Flat; Case Code (Imperial): 0402; Length: 1mm; REACH SVHC: No SVHC; Series: C
D36 = CMP-004-00040-2: Led, Red/Grn, 180Mcd/230Mcd, 624Nm/525Nm Rohs Compliant: Yes; Source: rgled.SchLib; Component Type: Standard; Pins: 4; Design Item ID: CMP-004-00034-2
J7 = CMP-03365-000001-1: CONN EDGE DUAL FMALE 67POS 0.020; Manufacturer: TE; Number Of Contacts: 67; Current Rating: 0.5A; Pitch: 0.5mm; Conn Gender: Female; Is Female: yes; Voltage Rating: 50V; Conn Orientation: Right Angle; Automotive: No; Temperature Range High: +80°C; Package: 1-2199230-6; Category: Conn; Temperature: -40°C to +80°C; Number Of Rows: 2; ComponentLink2URL: http://www.te.com/commerce/DocumentDelivery/DDEController?Action=showdoc&DocId=Specification+Or+Standard%7F114-115006%7FB%7Fpdf%7FEnglish%7FENG_SS_114-115006_B_114-115006_REV_B.pdf%7F1-2199230-6; Manufacturer Part Number: 1-2199230-6; Height: 4.2mm; RoHS: TRUE; Footprint Url: http://www.te.com/commerce/DocumentDelivery/DDEController?Action=showdoc&DocId=Customer+Drawing%7F2199230%7FB2%7Fpdf%7FEnglish%7FENG_CD_2199230_B2.pdf%7F1-2199230-6; Digikey Description: CONN EDGE DUAL FMALE 67POS 0.020; Device Class L2: Card Edge Connectors; Contact Material: Gold,Tin; Device Class L1: Connectors; Device Class L3: unset; ComponentLink2Description: Datasheet; Temperature Range Low: -40°C; Octopart: https://octopart.com/1-2199230-6-te+connectivity-34969376; Lead Free: Yes
MP3 MP4 = CMP-03913-59774857-1: 9774025243R Spacer Material: Steel, Tin-Plated Mounting: SMT Series: WA-SMST Thread D: M2; Outside Diameter: 4.3434mm; Threaded/Unthreaded: Threaded; Plating: Tin; REACH SVHC: Unknown; NexarPartId: 59774857; RoHS: Compliant; Material: Steel; Packaging: Tape and Reel; Max Operating Temperature: 150°C; Min Operating Temperature: -55°C; Length: 2.5mm; Height: 2.5mm
R97-R101 R103-R108 R111-R113 R226 R227 R288 R289 R291 R292 R294 = CMP-009-00118-2: READ THE NAME; Pins: 2; Component Type: Standard; Design Item ID: CMP-009-00206-2; Source: 0402jump.SchLib
R102 = CMP-2000-00443-2: RES SMD 33 OHM 1% 1/10W 0603; Voltage Rating (DC): 75V; Power Rating: 100mW; Resistance: 33R; Temperature Coefficient: 100ppm/°C; Min Operating Temperature: -55°C; Packaging: Tape and Reel; Mount: Surface Mount; Lead Free: Lead Free; Voltage Rating: 75V; Features: Automotive AEC-Q200; Height: 0.022inch; Width: 0.031inch; Number of Pins: 2; Package Quantity: 1; Case Code (Metric): 1608; Max Power Dissipation: 100mW; Case Code (Imperial): 0603; Termination: SMD/SMT; Resistance Tolerance: 1%; Max Operating Temperature: 155°C; Tolerance: 1%; Length: 1.6mm; Case/Package: 0603; Military Standard: Not; RoHS Compliant: Yes; Series: ERJ; Size Code: 0603; Construction: Rectangular; Number of Terminations: 2; Radiation Hardening: No; Resistor Type: Thick Film; Contact Plating: Tin; Depth: 0.8mm; REACH SVHC: No SVHC
R109 R110 = CMP-2000-00213-2: Chip Resistor, 120 Ohm, +/- 1%, 0.1 W, -55 to 155 degC, 0603 (1608 Metric), RoHS, Tape and Reel; Manufacturer: Panasonic; Power Rating: 100mW; Voltage Rating (DC): 75V; Resistance: 120Ohm; Temperature Coefficient: 100ppm/degreesC; Number of Terminations: 2; Military Standard: Not; Tolerance: 1%; Min Operating Temperature: -55degC; Packaging: TapeandReel; Lead Free: LeadFree; Max Operating Temperature: 155degC; Manufacturer URL: http://www.panasonic.com/; Case Code (Imperial): 0603; REACH SVHC: NoSVHC; Width: 0.031inch; Datasheet URL: https://industrial.panasonic.com/cdbs/www-data/pdf/RDA0000/AOA0000C283.pdf; RoHSCompliant: true; Max Power Dissipation: 100mW; Termination: SMD/SMT; Package Reference: 0603; Height: 0.022inch; Depth: 0.8mm; Package Description: 2-Pin Surface Mount Device, Body 1.6 x 0.85 mm; Contact Plating: Tin; Length: 1.6mm; Package URL: http://www.st.com/st-web-ui/static/active/en/resource/technical/document/datasheet/CD00001320.pdf; Radiation Hardening: No; Package Quantity: 1; Number of Pins: 2; Datasheet Version: 42095.0; Voltage Rating: 75V; Composition: ThickFilm; Case/Package: 0603; Mount: SurfaceMount; Case Code (Metric): 1608
R290 R293 = CMP-1012-00623-3: as R75 on sheet HDMI; Number of Pins: 2; Package Reference: 603; Depth: 0.8mm; Mount: SurfaceMount; Package Description: 2-Pin Surface Mount Device, Body 1.6 x 0.85 mm; Datasheet Version: 02/2017; Length: 1.6mm; Lead Free: LeadFree; Height: 0.45mm; Number of Terminations: 2; Max Power Dissipation: 100mW; Min Operating Temperature: -55degC; Datasheet URL: https://industrial.panasonic.com/cdbs/www-data/pdf/RDA0000/AOA0000C304.pdf; Termination: SMD/SMT; Case Code (Metric): 1608; Case Code (Imperial): 0603; Tolerance: 1%; Max Operating Temperature: 155degC; RoHSCompliant: true; Voltage Rating (DC): 75V; Radiation Hardening: No; Packaging: TapeandReel; Composition: ThickFilm; Mounting Technology: SurfaceMount; Manufacturer URL: http://www.panasonic.com/; Width: 0.031inch; REACH SVHC: NoSVHC; Contact Plating: Tin; Military Standard: Not; Package Quantity: 1
TP9-TP11 = CMP-00025-2: Test Point .6mm
Y3 = CMP-27762-001115-1: XTAL OSC XO 32.7680KHZ CMOS SMD; Load Capacitance: 15pF; Max Supply Current: 3.5mA; Min Supply Voltage: 2.97V; Operating Supply Voltage: 3.3V; Frequency Stability: 25ppm; Lead Free: Lead Free; Case/Package: CSMD; Number of Pins: 4; Max Operating Temperature: 85°C; Packaging: Tape and Reel; Width: 0.079inch; Min Operating Temperature: -40°C; Radiation Hardening: No; Length: 2.5mm; Depth: 2mm; Termination: SMD/SMT; Height: 0.037inch; Series: ASDK; Frequency: 32.768kHz; Mount: Surface Mount